# Altium schematic sheet 301_PowerGridUSB.SchDoc: Power to USB Connectors Grid
size A2; Organization: Greenfield Tech Solutions; Address1: Molendreef 33; Address2: Ossendrecht; Address3: 4641CS; Address4: The Netherlands; SheetNumber: 4; SheetTotal: 4
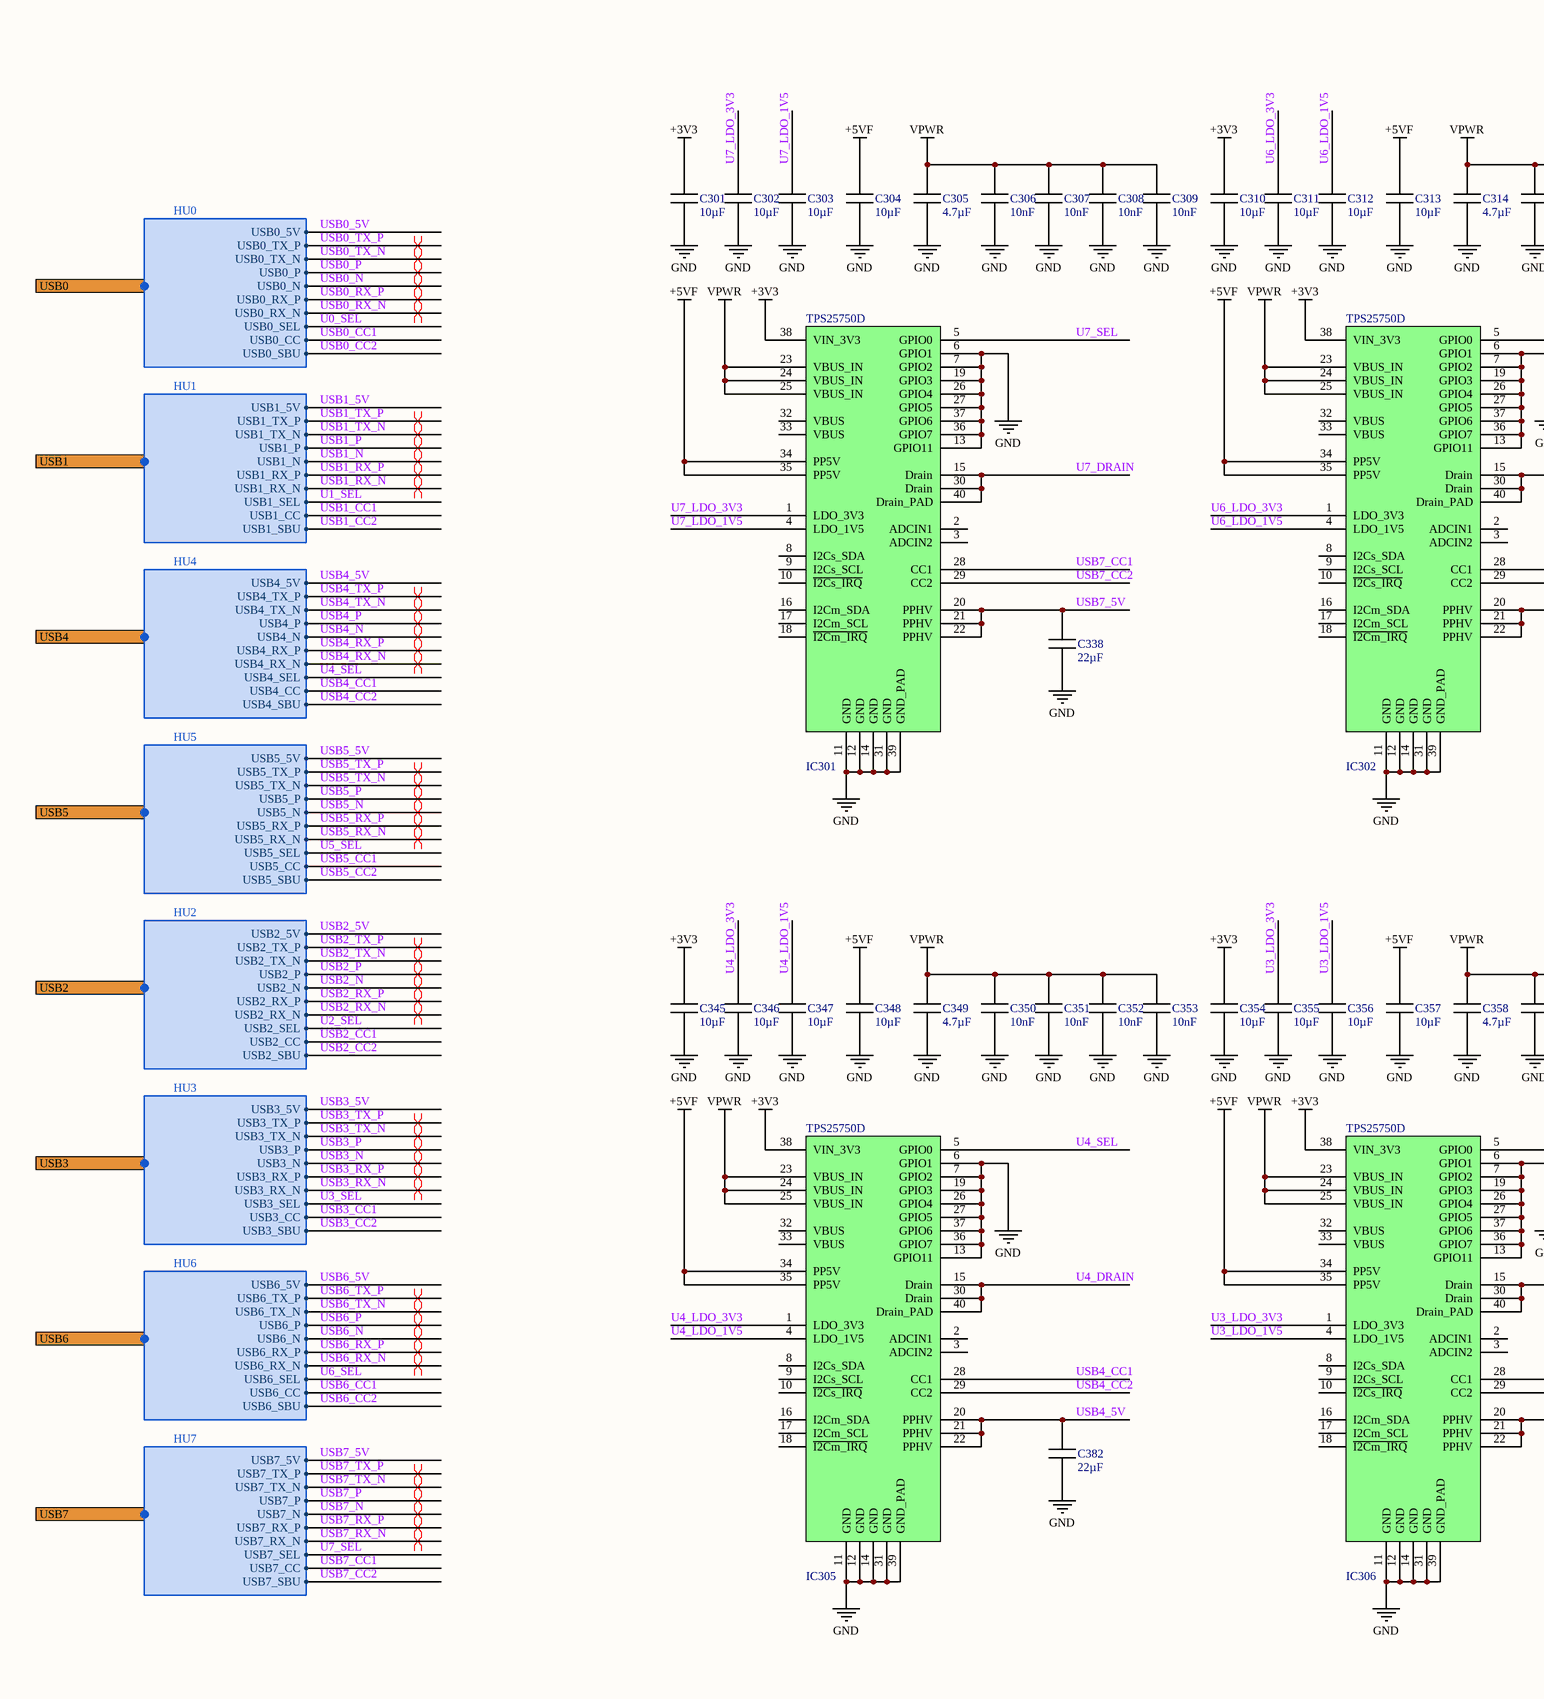
[diagram p0: 301_PowerGridUSB.SchDoc, left]
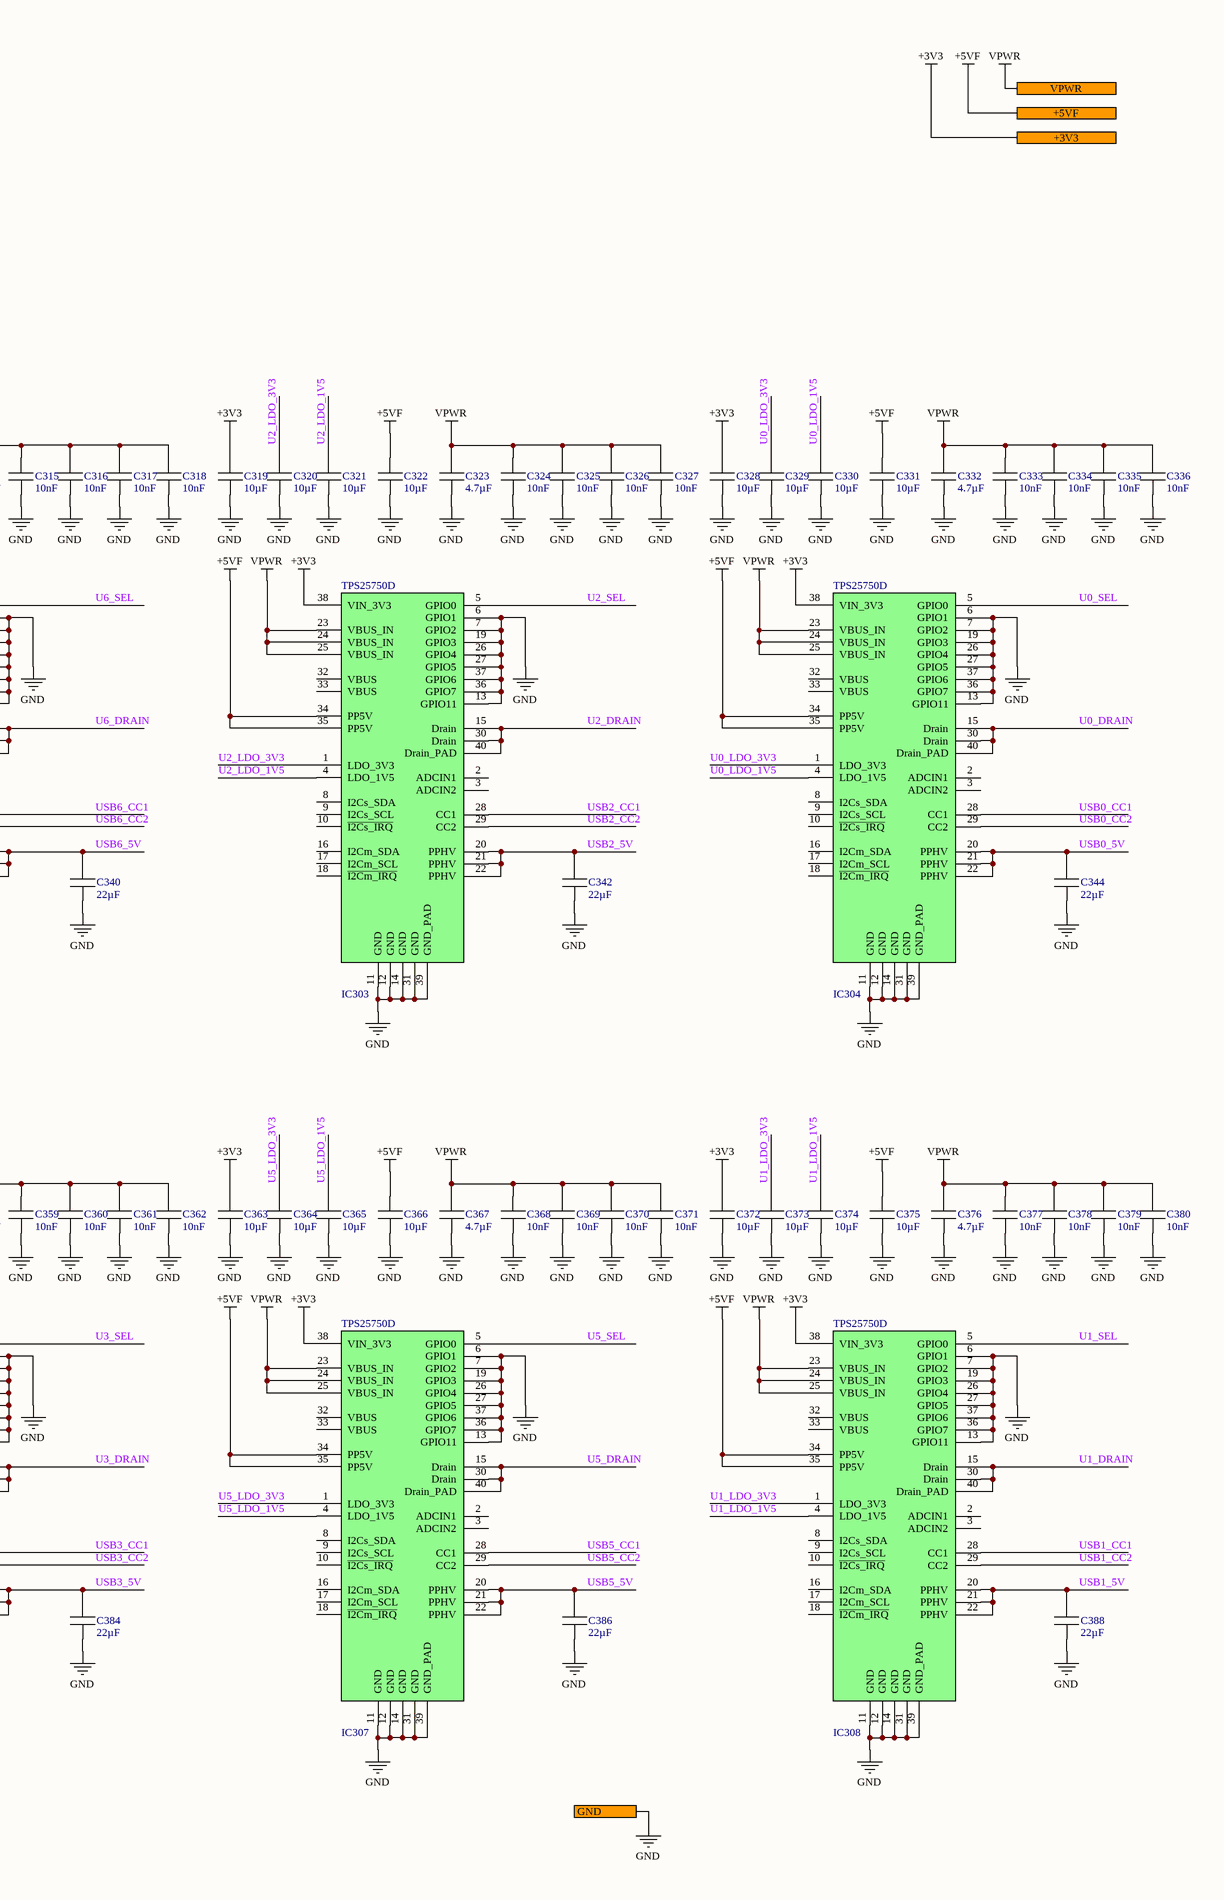
[diagram p1: 301_PowerGridUSB.SchDoc, right]

## Parts
C301  10µF  [C0805]
C302  10µF  [C0805]
C303  10µF  [C0805]
C304  10µF  [C0805]
C305  4.7µF  [C1210]
C306  10nF  [C0805]
C307  10nF  [C0805]
C308  10nF  [C0805]
C309  10nF  [C0805]
C310  10µF  [C0805]
C311  10µF  [C0805]
C312  10µF  [C0805]
C313  10µF  [C0805]
C314  4.7µF  [C1210]
C315  10nF  [C0805]
C316  10nF  [C0805]
C317  10nF  [C0805]
C318  10nF  [C0805]
C319  10µF  [C0805]
C320  10µF  [C0805]
C321  10µF  [C0805]
C322  10µF  [C0805]
C323  4.7µF  [C1210]
C324  10nF  [C0805]
C325  10nF  [C0805]
C326  10nF  [C0805]
C327  10nF  [C0805]
C328  10µF  [C0805]
C329  10µF  [C0805]
C330  10µF  [C0805]
C331  10µF  [C0805]
C332  4.7µF  [C1210]
C333  10nF  [C0805]
C334  10nF  [C0805]
C335  10nF  [C0805]
C336  10nF  [C0805]
C338  22µF  [C2220]
C340  22µF  [C2220]
C342  22µF  [C2220]
C344  22µF  [C2220]
C345  10µF  [C0805]
C346  10µF  [C0805]
C347  10µF  [C0805]
C348  10µF  [C0805]
C349  4.7µF  [C1210]
C350  10nF  [C0805]
C351  10nF  [C0805]
C352  10nF  [C0805]
C353  10nF  [C0805]
C354  10µF  [C0805]
C355  10µF  [C0805]
C356  10µF  [C0805]
C357  10µF  [C0805]
C358  4.7µF  [C1210]
C359  10nF  [C0805]
C360  10nF  [C0805]
C361  10nF  [C0805]
C362  10nF  [C0805]
C363  10µF  [C0805]
C364  10µF  [C0805]
C365  10µF  [C0805]
C366  10µF  [C0805]
C367  4.7µF  [C1210]
C368  10nF  [C0805]
C369  10nF  [C0805]
C370  10nF  [C0805]
C371  10nF  [C0805]
C372  10µF  [C0805]
C373  10µF  [C0805]
C374  10µF  [C0805]
C375  10µF  [C0805]
C376  4.7µF  [C1210]
C377  10nF  [C0805]
C378  10nF  [C0805]
C379  10nF  [C0805]
C380  10nF  [C0805]
C382  22µF  [C2220]
C384  22µF  [C2220]
C386  22µF  [C2220]
C388  22µF  [C2220]
IC301  TPS25750D  [QFNRJK-38]
IC302  TPS25750D  [QFNRJK-38]
IC303  TPS25750D  [QFNRJK-38]
IC304  TPS25750D  [QFNRJK-38]
IC305  TPS25750D  [QFNRJK-38]
IC306  TPS25750D  [QFNRJK-38]
IC307  TPS25750D  [QFNRJK-38]
IC308  TPS25750D  [QFNRJK-38]

## Ports
+3V3, +5VF, GND, USB0 (harness HU0), USB1 (harness HU1), USB2 (harness HU2), USB3 (harness HU3), USB4 (harness HU4), USB5 (harness HU5), USB6 (harness HU6), USB7 (harness HU7), VPWR

## Harnesses
HU0: USB0_5V, USB0_TX_P, USB0_TX_N, USB0_N, USB0_RX_P, USB0_RX_N, USB0_SEL, USB0_P, USB0_CC, USB0_SBU
HU5: USB5_5V, USB5_TX_P, USB5_TX_N, USB5_N, USB5_RX_P, USB5_RX_N, USB5_SEL, USB5_P, USB5_CC, USB5_SBU
HU4: USB4_5V, USB4_TX_P, USB4_TX_N, USB4_N, USB4_RX_P, USB4_RX_N, USB4_SEL, USB4_P, USB4_CC, USB4_SBU
HU1: USB1_5V, USB1_TX_P, USB1_TX_N, USB1_N, USB1_RX_P, USB1_RX_N, USB1_SEL, USB1_P, USB1_CC, USB1_SBU
HU7: USB7_5V, USB7_TX_P, USB7_TX_N, USB7_N, USB7_RX_P, USB7_RX_N, USB7_SEL, USB7_P, USB7_CC, USB7_SBU
HU6: USB6_5V, USB6_TX_P, USB6_TX_N, USB6_N, USB6_RX_P, USB6_RX_N, USB6_SEL, USB6_P, USB6_CC, USB6_SBU
HU3: USB3_5V, USB3_TX_P, USB3_TX_N, USB3_N, USB3_RX_P, USB3_RX_N, USB3_SEL, USB3_P, USB3_CC, USB3_SBU
HU2: USB2_5V, USB2_TX_P, USB2_TX_N, USB2_N, USB2_RX_P, USB2_RX_N, USB2_SEL, USB2_P, USB2_CC, USB2_SBU

## Nets
+3V3: C301.1 C310.1 C319.1 C328.1 C345.1 C354.1 C363.1 C372.1 IC301.38(VIN_3V3) IC302.38(VIN_3V3) IC303.38(VIN_3V3) IC304.38(VIN_3V3) IC305.38(VIN_3V3) IC306.38(VIN_3V3) IC307.38(VIN_3V3) IC308.38(VIN_3V3) ; port +3V3
+5VF: C304.1 C313.1 C322.1 C331.1 C348.1 C357.1 C366.1 C375.1 IC301.34(PP5V) IC301.35(PP5V) IC302.34(PP5V) IC302.35(PP5V) IC303.34(PP5V) IC303.35(PP5V) IC304.34(PP5V) IC304.35(PP5V) IC305.34(PP5V) IC305.35(PP5V) IC306.34(PP5V) IC306.35(PP5V) IC307.34(PP5V) IC307.35(PP5V) IC308.34(PP5V) IC308.35(PP5V) ; port +5VF
GND: C301.2 C302.2 C303.2 C304.2 C305.2 C306.2 C307.2 C308.2 C309.2 C310.2 C311.2 C312.2 C313.2 C314.2 C315.2 C316.2 C317.2 C318.2 C319.2 C320.2 C321.2 C322.2 C323.2 C324.2 C325.2 C326.2 C327.2 C328.2 C329.2 C330.2 C331.2 C332.2 C333.2 C334.2 C335.2 C336.2 C338.2 C340.2 C342.2 C344.2 C345.2 C346.2 C347.2 C348.2 C349.2 C350.2 C351.2 C352.2 C353.2 C354.2 C355.2 C356.2 C357.2 C358.2 C359.2 C360.2 C361.2 C362.2 C363.2 C364.2 C365.2 C366.2 C367.2 C368.2 C369.2 C370.2 C371.2 C372.2 C373.2 C374.2 C375.2 C376.2 C377.2 C378.2 C379.2 C380.2 C382.2 C384.2 C386.2 C388.2 IC301.6(GPIO1) IC301.7(GPIO2) IC301.11(GND) IC301.12(GND) IC301.13(GPIO11) IC301.14(GND) IC301.19(GPIO3) IC301.26(GPIO4) IC301.27(GPIO5) IC301.31(GND) IC301.36(GPIO7) IC301.37(GPIO6) IC301.39(GND_PAD) IC302.6(GPIO1) IC302.7(GPIO2) IC302.11(GND) IC302.12(GND) IC302.13(GPIO11) IC302.14(GND) IC302.19(GPIO3) IC302.26(GPIO4) IC302.27(GPIO5) IC302.31(GND) IC302.36(GPIO7) IC302.37(GPIO6) IC302.39(GND_PAD) IC303.6(GPIO1) IC303.7(GPIO2) IC303.11(GND) IC303.12(GND) IC303.13(GPIO11) IC303.14(GND) IC303.19(GPIO3) IC303.26(GPIO4) IC303.27(GPIO5) IC303.31(GND) IC303.36(GPIO7) IC303.37(GPIO6) IC303.39(GND_PAD) IC304.6(GPIO1) IC304.7(GPIO2) IC304.11(GND) IC304.12(GND) IC304.13(GPIO11) IC304.14(GND) IC304.19(GPIO3) IC304.26(GPIO4) IC304.27(GPIO5) IC304.31(GND) IC304.36(GPIO7) IC304.37(GPIO6) IC304.39(GND_PAD) IC305.6(GPIO1) IC305.7(GPIO2) IC305.11(GND) IC305.12(GND) IC305.13(GPIO11) IC305.14(GND) IC305.19(GPIO3) IC305.26(GPIO4) IC305.27(GPIO5) IC305.31(GND) IC305.36(GPIO7) IC305.37(GPIO6) IC305.39(GND_PAD) IC306.6(GPIO1) IC306.7(GPIO2) IC306.11(GND) IC306.12(GND) IC306.13(GPIO11) IC306.14(GND) IC306.19(GPIO3) IC306.26(GPIO4) IC306.27(GPIO5) IC306.31(GND) IC306.36(GPIO7) IC306.37(GPIO6) IC306.39(GND_PAD) IC307.6(GPIO1) IC307.7(GPIO2) IC307.11(GND) IC307.12(GND) IC307.13(GPIO11) IC307.14(GND) IC307.19(GPIO3) IC307.26(GPIO4) IC307.27(GPIO5) IC307.31(GND) IC307.36(GPIO7) IC307.37(GPIO6) IC307.39(GND_PAD) IC308.6(GPIO1) IC308.7(GPIO2) IC308.11(GND) IC308.12(GND) IC308.13(GPIO11) IC308.14(GND) IC308.19(GPIO3) IC308.26(GPIO4) IC308.27(GPIO5) IC308.31(GND) IC308.36(GPIO7) IC308.37(GPIO6) IC308.39(GND_PAD) ; port GND
VPWR: C305.1 C306.1 C307.1 C308.1 C309.1 C314.1 C315.1 C316.1 C317.1 C318.1 C323.1 C324.1 C325.1 C326.1 C327.1 C332.1 C333.1 C334.1 C335.1 C336.1 C349.1 C350.1 C351.1 C352.1 C353.1 C358.1 C359.1 C360.1 C361.1 C362.1 C367.1 C368.1 C369.1 C370.1 C371.1 C376.1 C377.1 C378.1 C379.1 C380.1 IC301.23(VBUS_IN) IC301.24(VBUS_IN) IC301.25(VBUS_IN) IC302.23(VBUS_IN) IC302.24(VBUS_IN) IC302.25(VBUS_IN) IC303.23(VBUS_IN) IC303.24(VBUS_IN) IC303.25(VBUS_IN) IC304.23(VBUS_IN) IC304.24(VBUS_IN) IC304.25(VBUS_IN) IC305.23(VBUS_IN) IC305.24(VBUS_IN) IC305.25(VBUS_IN) IC306.23(VBUS_IN) IC306.24(VBUS_IN) IC306.25(VBUS_IN) IC307.23(VBUS_IN) IC307.24(VBUS_IN) IC307.25(VBUS_IN) IC308.23(VBUS_IN) IC308.24(VBUS_IN) IC308.25(VBUS_IN) ; port VPWR
U0_DRAIN: IC304.15(Drain) IC304.30(Drain) IC304.40(Drain_PAD)
U0_LDO_1V5: C330.1 IC304.4(LDO_1V5)
U0_LDO_3V3: C329.1 IC304.1(LDO_3V3)
U0_SEL: IC304.5(GPIO0) ; port USB0.USB0_SEL
U1_DRAIN: IC308.15(Drain) IC308.30(Drain) IC308.40(Drain_PAD)
U1_LDO_1V5: C374.1 IC308.4(LDO_1V5)
U1_LDO_3V3: C373.1 IC308.1(LDO_3V3)
U1_SEL: IC308.5(GPIO0) ; port USB1.USB1_SEL
U2_DRAIN: IC303.15(Drain) IC303.30(Drain) IC303.40(Drain_PAD)
U2_LDO_1V5: C321.1 IC303.4(LDO_1V5)
U2_LDO_3V3: C320.1 IC303.1(LDO_3V3)
U2_SEL: IC303.5(GPIO0) ; port USB2.USB2_SEL
U3_DRAIN: IC306.15(Drain) IC306.30(Drain) IC306.40(Drain_PAD)
U3_LDO_1V5: C356.1 IC306.4(LDO_1V5)
U3_LDO_3V3: C355.1 IC306.1(LDO_3V3)
U3_SEL: IC306.5(GPIO0) ; port USB3.USB3_SEL
U4_DRAIN: IC305.15(Drain) IC305.30(Drain) IC305.40(Drain_PAD)
U4_LDO_1V5: C347.1 IC305.4(LDO_1V5)
U4_LDO_3V3: C346.1 IC305.1(LDO_3V3)
U4_SEL: IC305.5(GPIO0) ; port USB4.USB4_SEL
U5_DRAIN: IC307.15(Drain) IC307.30(Drain) IC307.40(Drain_PAD)
U5_LDO_1V5: C365.1 IC307.4(LDO_1V5)
U5_LDO_3V3: C364.1 IC307.1(LDO_3V3)
U5_SEL: IC307.5(GPIO0) ; port USB5.USB5_SEL
U6_DRAIN: IC302.15(Drain) IC302.30(Drain) IC302.40(Drain_PAD)
U6_LDO_1V5: C312.1 IC302.4(LDO_1V5)
U6_LDO_3V3: C311.1 IC302.1(LDO_3V3)
U6_SEL: IC302.5(GPIO0) ; port USB6.USB6_SEL
U7_DRAIN: IC301.15(Drain) IC301.30(Drain) IC301.40(Drain_PAD)
U7_LDO_1V5: C303.1 IC301.4(LDO_1V5)
U7_LDO_3V3: C302.1 IC301.1(LDO_3V3)
U7_SEL: IC301.5(GPIO0) ; port USB7.USB7_SEL
USB0_5V: C344.1 IC304.20(PPHV) IC304.21(PPHV) IC304.22(PPHV) ; port USB0.USB0_5V
USB0_CC1: IC304.28(CC1) ; port USB0.USB0_CC
USB0_CC2: IC304.29(CC2) ; port USB0.USB0_SBU
USB0_N: port USB0.USB0_N
USB0_P: port USB0.USB0_P
USB0_RX_N: port USB0.USB0_RX_N
USB0_RX_P: port USB0.USB0_RX_P
USB0_TX_N: port USB0.USB0_TX_N
USB0_TX_P: port USB0.USB0_TX_P
USB1_5V: C388.1 IC308.20(PPHV) IC308.21(PPHV) IC308.22(PPHV) ; port USB1.USB1_5V
USB1_CC1: IC308.28(CC1) ; port USB1.USB1_CC
USB1_CC2: IC308.29(CC2) ; port USB1.USB1_SBU
USB1_N: port USB1.USB1_N
USB1_P: port USB1.USB1_P
USB1_RX_N: port USB1.USB1_RX_N
USB1_RX_P: port USB1.USB1_RX_P
USB1_TX_N: port USB1.USB1_TX_N
USB1_TX_P: port USB1.USB1_TX_P
USB2_5V: C342.1 IC303.20(PPHV) IC303.21(PPHV) IC303.22(PPHV) ; port USB2.USB2_5V
USB2_CC1: IC303.28(CC1) ; port USB2.USB2_CC
USB2_CC2: IC303.29(CC2) ; port USB2.USB2_SBU
USB2_N: port USB2.USB2_N
USB2_P: port USB2.USB2_P
USB2_RX_N: port USB2.USB2_RX_N
USB2_RX_P: port USB2.USB2_RX_P
USB2_TX_N: port USB2.USB2_TX_N
USB2_TX_P: port USB2.USB2_TX_P
USB3_5V: C384.1 IC306.20(PPHV) IC306.21(PPHV) IC306.22(PPHV) ; port USB3.USB3_5V
USB3_CC1: IC306.28(CC1) ; port USB3.USB3_CC
USB3_CC2: IC306.29(CC2) ; port USB3.USB3_SBU
USB3_N: port USB3.USB3_N
USB3_P: port USB3.USB3_P
USB3_RX_N: port USB3.USB3_RX_N
USB3_RX_P: port USB3.USB3_RX_P
USB3_TX_N: port USB3.USB3_TX_N
USB3_TX_P: port USB3.USB3_TX_P
USB4_5V: C382.1 IC305.20(PPHV) IC305.21(PPHV) IC305.22(PPHV) ; port USB4.USB4_5V
USB4_CC1: IC305.28(CC1) ; port USB4.USB4_CC
USB4_CC2: IC305.29(CC2) ; port USB4.USB4_SBU
USB4_N: port USB4.USB4_N
USB4_P: port USB4.USB4_P
USB4_RX_N: port USB4.USB4_RX_N
USB4_RX_P: port USB4.USB4_RX_P
USB4_TX_N: port USB4.USB4_TX_N
USB4_TX_P: port USB4.USB4_TX_P
USB5_5V: C386.1 IC307.20(PPHV) IC307.21(PPHV) IC307.22(PPHV) ; port USB5.USB5_5V
USB5_CC1: IC307.28(CC1) ; port USB5.USB5_CC
USB5_CC2: IC307.29(CC2) ; port USB5.USB5_SBU
USB5_N: port USB5.USB5_N
USB5_P: port USB5.USB5_P
USB5_RX_N: port USB5.USB5_RX_N
USB5_RX_P: port USB5.USB5_RX_P
USB5_TX_N: port USB5.USB5_TX_N
USB5_TX_P: port USB5.USB5_TX_P
USB6_5V: C340.1 IC302.20(PPHV) IC302.21(PPHV) IC302.22(PPHV) ; port USB6.USB6_5V
USB6_CC1: IC302.28(CC1) ; port USB6.USB6_CC
USB6_CC2: IC302.29(CC2) ; port USB6.USB6_SBU
USB6_N: port USB6.USB6_N
USB6_P: port USB6.USB6_P
USB6_RX_N: port USB6.USB6_RX_N
USB6_RX_P: port USB6.USB6_RX_P
USB6_TX_N: port USB6.USB6_TX_N
USB6_TX_P: port USB6.USB6_TX_P
USB7_5V: C338.1 IC301.20(PPHV) IC301.21(PPHV) IC301.22(PPHV) ; port USB7.USB7_5V
USB7_CC1: IC301.28(CC1) ; port USB7.USB7_CC
USB7_CC2: IC301.29(CC2) ; port USB7.USB7_SBU
USB7_N: port USB7.USB7_N
USB7_P: port USB7.USB7_P
USB7_RX_N: port USB7.USB7_RX_N
USB7_RX_P: port USB7.USB7_RX_P
USB7_TX_N: port USB7.USB7_TX_N
USB7_TX_P: port USB7.USB7_TX_P

Not connected (* = marked no-connect by the designer): IC301 2(ADCIN1) 3(ADCIN2) 8(I2Cs_SDA) 9(I2Cs_SCL) 10(~{I2Cs_IRQ}) 16(I2Cm_SDA) 17(I2Cm_SCL) 18(~{I2Cm_IRQ}) 32(VBUS) 33(VBUS); IC302 2(ADCIN1) 3(ADCIN2) 8(I2Cs_SDA) 9(I2Cs_SCL) 10(~{I2Cs_IRQ}) 16(I2Cm_SDA) 17(I2Cm_SCL) 18(~{I2Cm_IRQ}) 32(VBUS) 33(VBUS); IC303 2(ADCIN1) 3(ADCIN2) 8(I2Cs_SDA) 9(I2Cs_SCL) 10(~{I2Cs_IRQ}) 16(I2Cm_SDA) 17(I2Cm_SCL) 18(~{I2Cm_IRQ}) 32(VBUS) 33(VBUS); IC304 2(ADCIN1) 3(ADCIN2) 8(I2Cs_SDA) 9(I2Cs_SCL) 10(~{I2Cs_IRQ}) 16(I2Cm_SDA) 17(I2Cm_SCL) 18(~{I2Cm_IRQ}) 32(VBUS) 33(VBUS); IC305 2(ADCIN1) 3(ADCIN2) 8(I2Cs_SDA) 9(I2Cs_SCL) 10(~{I2Cs_IRQ}) 16(I2Cm_SDA) 17(I2Cm_SCL) 18(~{I2Cm_IRQ}) 32(VBUS) 33(VBUS); IC306 2(ADCIN1) 3(ADCIN2) 8(I2Cs_SDA) 9(I2Cs_SCL) 10(~{I2Cs_IRQ}) 16(I2Cm_SDA) 17(I2Cm_SCL) 18(~{I2Cm_IRQ}) 32(VBUS) 33(VBUS); IC307 2(ADCIN1) 3(ADCIN2) 8(I2Cs_SDA) 9(I2Cs_SCL) 10(~{I2Cs_IRQ}) 16(I2Cm_SDA) 17(I2Cm_SCL) 18(~{I2Cm_IRQ}) 32(VBUS) 33(VBUS); IC308 2(ADCIN1) 3(ADCIN2) 8(I2Cs_SDA) 9(I2Cs_SCL) 10(~{I2Cs_IRQ}) 16(I2Cm_SDA) 17(I2Cm_SCL) 18(~{I2Cm_IRQ}) 32(VBUS) 33(VBUS)

## Layout directives
differential pair; differential pair class USB3: USB0_N, USB0_P, USB0_RX_N, USB0_RX_P, USB0_TX_N, USB0_TX_P, USB1_N, USB1_P, USB1_RX_N, USB1_RX_P, USB1_TX_N, USB1_TX_P, USB2_N, USB2_P, USB2_RX_N, USB2_RX_P, USB2_TX_N, USB2_TX_P, USB3_N, USB3_P, USB3_RX_N, USB3_RX_P, USB3_TX_N, USB3_TX_P, USB4_N, USB4_P, USB4_RX_N, USB4_RX_P, USB4_TX_N, USB4_TX_P, USB5_N, USB5_P, USB5_RX_N, USB5_RX_P, USB5_TX_N, USB5_TX_P, USB6_N, USB6_P, USB6_RX_N, USB6_RX_P, USB6_TX_N, USB6_TX_P, USB7_N, USB7_P, USB7_RX_N, USB7_RX_P, USB7_TX_N, USB7_TX_P

## Notes on the sheet
- Title
- Size:
- Date:
- File:
- A2
- Number:
- Time:
- Revision:
- Sheet
- of

## Library data of the parts
C301-C304 C310-C313 C319-C322 C328-C331 C345-C348 C354-C357 C363-C366 C372-C375 = CA0001: 10µF 16V 10% X5R; Part Number: CA0001; ManfactPart: GRM21BR61C106KE15L; ID: 1; RefVal: 10µF
C305 C314 C323 C332 C349 C358 C367 C376 = CA0038: 4.7µF 100V 10% X5R; Part Number: CA0038; ManfactPart: HMK325BJ475KM-PE; ID: 38; RefVal: 4.7µF
C306-C309 C315-C318 C324-C327 C333-C336 C350-C353 C359-C362 C368-C371 C377-C380 = CA0021: 10nF 50V 10% X7R; Part Number: CA0021; ManfactPart: C0805C103K5RAC; ID: 21; RefVal: 10nF
C338 C340 C342 C344 C382 C384 C386 C388 = CA0051: 22µF 63V 20% X7R; Part Number: CA0051; ManfactPart: KRM55WR71J226MH01K; ID: 51; RefVal: 22µF
IC301-IC308 = IC0041: USB Type-C and USB PD Controller with Integrated Power Switches Optimized for Power Applications; Part Number: IC0041; ID: 41; RefVal: TPS25750D; ManfactPart: TPS25750D